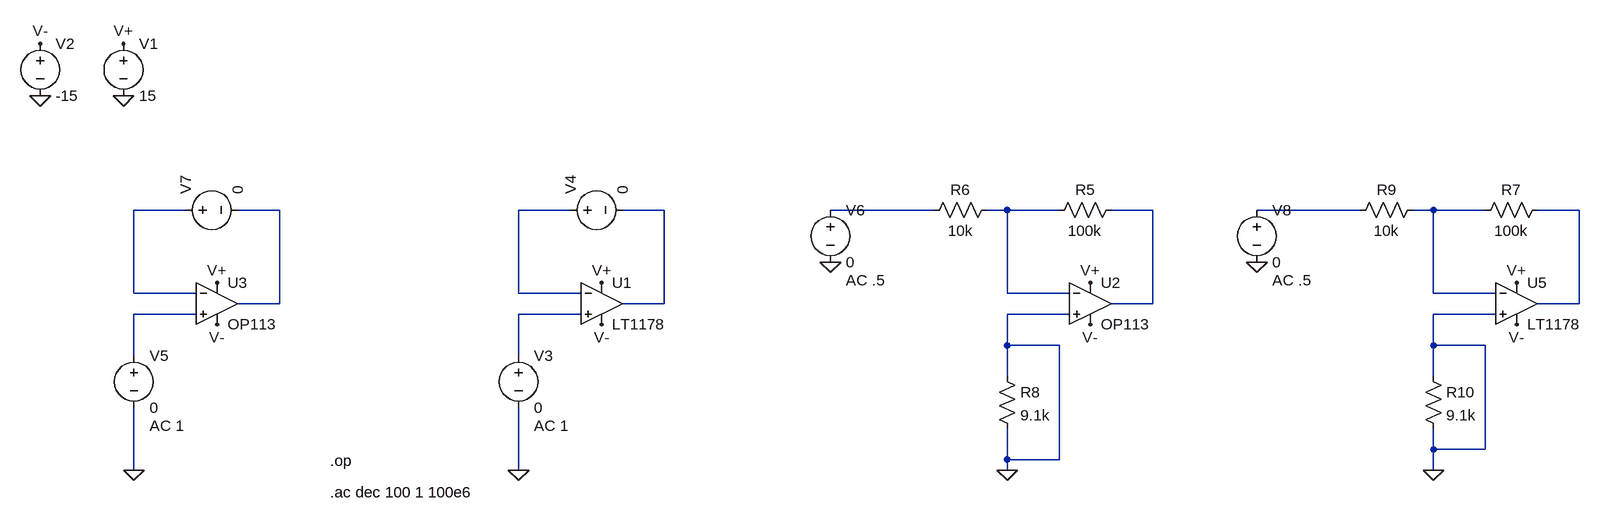
[diagram p0: schematic input_current.asc]
input_current.asc, the LTspice schematic file:
Version 4
SHEET 1 1896 680
WIRE -464 32 -544 32
WIRE -320 32 -384 32
WIRE 128 32 48 32
WIRE 272 32 208 32
WIRE 688 32 528 32
WIRE 800 32 768 32
WIRE 880 32 800 32
WIRE 1024 32 960 32
WIRE 1344 32 1184 32
WIRE 1456 32 1424 32
WIRE 1536 32 1456 32
WIRE 1680 32 1616 32
WIRE -544 160 -544 32
WIRE -448 160 -544 160
WIRE 48 160 48 32
WIRE 144 160 48 160
WIRE 800 160 800 32
WIRE 896 160 800 160
WIRE 1456 160 1456 32
WIRE 1552 160 1456 160
WIRE -320 176 -320 32
WIRE -320 176 -384 176
WIRE 272 176 272 32
WIRE 272 176 208 176
WIRE 1024 176 1024 32
WIRE 1024 176 960 176
WIRE 1680 176 1680 32
WIRE 1680 176 1616 176
WIRE -448 192 -544 192
WIRE 144 192 48 192
WIRE 896 192 800 192
WIRE 1552 192 1456 192
WIRE 800 240 800 192
WIRE 880 240 800 240
WIRE 1456 240 1456 192
WIRE 1536 240 1456 240
WIRE -544 256 -544 192
WIRE 48 256 48 192
WIRE 800 288 800 240
WIRE 1456 288 1456 240
WIRE 1456 400 1456 368
WIRE 1536 400 1536 240
WIRE 1536 400 1456 400
WIRE 800 416 800 368
WIRE 880 416 880 240
WIRE 880 416 800 416
WIRE -544 432 -544 336
WIRE 48 432 48 336
WIRE 800 432 800 416
WIRE 1456 432 1456 400
FLAG -560 -144 0
FLAG -560 -224 V+
FLAG -688 -144 0
FLAG -688 -224 V-
FLAG 928 144 V+
FLAG 928 208 V-
FLAG 528 112 0
FLAG 800 432 0
FLAG -416 144 V+
FLAG -416 208 V-
FLAG -544 432 0
FLAG 1584 144 V+
FLAG 1584 208 V-
FLAG 1184 112 0
FLAG 1456 432 0
FLAG 176 144 V+
FLAG 176 208 V-
FLAG 48 432 0
DATAFLAG 1024 112 ""
DATAFLAG 832 32 "I(R5)"
DATAFLAG -528 192 "I(V5)"
DATAFLAG -528 32 "I(V7)"
DATAFLAG 1680 112 ""
DATAFLAG 1472 192 ""
DATAFLAG 1488 32 ""
DATAFLAG 816 192 "I(R8)"
DATAFLAG 608 32 "I(R6)"
DATAFLAG 1456 256 "I(R10)"
DATAFLAG 64 192 "I(V3)"
DATAFLAG 64 32 "I(V4)"
DATAFLAG -320 32 ""
SYMBOL voltage -560 -240 R0
WINDOW 123 0 0 Left 0
WINDOW 39 0 0 Left 0
SYMATTR InstName V1
SYMATTR Value 15
SYMBOL voltage -688 -240 R0
WINDOW 123 0 0 Left 0
WINDOW 39 0 0 Left 0
SYMATTR InstName V2
SYMATTR Value -15
SYMBOL Opamps\\OP113 928 112 R0
SYMATTR InstName U2
SYMBOL res 976 16 R90
WINDOW 0 0 56 VBottom 2
WINDOW 3 32 56 VTop 2
SYMATTR InstName R5
SYMATTR Value 100k
SYMBOL res 784 16 R90
WINDOW 0 0 56 VBottom 2
WINDOW 3 32 56 VTop 2
SYMATTR InstName R6
SYMATTR Value 10k
SYMBOL res 784 272 R0
SYMATTR InstName R8
SYMATTR Value 9.1k
SYMBOL voltage 528 16 R0
WINDOW 123 24 124 Left 2
WINDOW 39 0 0 Left 0
SYMATTR Value2 AC .5
SYMATTR InstName V6
SYMATTR Value 0
SYMBOL Opamps\\OP113 -416 112 R0
SYMATTR InstName U3
SYMBOL voltage -544 240 R0
WINDOW 123 24 124 Left 2
WINDOW 39 0 0 Left 0
SYMATTR Value2 AC 1
SYMATTR InstName V5
SYMATTR Value 0
SYMBOL voltage -480 32 R270
WINDOW 123 24 124 Left 2
WINDOW 39 0 0 Left 0
SYMATTR InstName V7
SYMATTR Value 0
SYMBOL res 1632 16 R90
WINDOW 0 0 56 VBottom 2
WINDOW 3 32 56 VTop 2
SYMATTR InstName R7
SYMATTR Value 100k
SYMBOL res 1440 16 R90
WINDOW 0 0 56 VBottom 2
WINDOW 3 32 56 VTop 2
SYMATTR InstName R9
SYMATTR Value 10k
SYMBOL res 1440 272 R0
SYMATTR InstName R10
SYMATTR Value 9.1k
SYMBOL voltage 1184 16 R0
WINDOW 123 24 124 Left 2
WINDOW 39 0 0 Left 0
SYMATTR Value2 AC .5
SYMATTR InstName V8
SYMATTR Value 0
SYMBOL Opamps\\LT1178 1584 112 R0
SYMATTR InstName U5
SYMBOL voltage 48 240 R0
WINDOW 123 24 124 Left 2
WINDOW 39 0 0 Left 0
SYMATTR Value2 AC 1
SYMATTR InstName V3
SYMATTR Value 0
SYMBOL voltage 112 32 R270
WINDOW 123 24 124 Left 2
WINDOW 39 0 0 Left 0
SYMATTR InstName V4
SYMATTR Value 0
SYMBOL Opamps\\LT1178 176 112 R0
SYMATTR InstName U1
TEXT -242 418 Left 2 !.op
TEXT -242 466 Left 2 !.ac dec 100 1 100e6

The netlist it stands for:
* input_current.asc
V1 V+ 0 15
V2 V- 0 -15
XU2 0 N006 V+ V- N007 OP113  ; pins In+ In- V+ V- OUT
R5 N007 N006 100k
R6 N006 N005 10k
R8 0 0 9.1k
V6 N005 0 0 AC .5
XU3 N011 N001 V+ V- N002 OP113  ; pins In+ In- V+ V- OUT
V5 N011 0 0 AC 1
V7 N001 N002 0
R7 N010 N009 100k
R9 N009 N008 10k
R10 0 0 9.1k
V8 N008 0 0 AC .5
XU5 0 N009 V+ V- N010 LT1178  ; pins In+ In- V+ V- OUT
V3 N012 0 0 AC 1
V4 N003 N004 0
XU1 N012 N003 V+ V- N004 LT1178  ; pins In+ In- V+ V- OUT
.op
.ac dec 100 1 100e6
.lib ADI.lib
.backanno
.end